# Altium schematic sheet WiFi.SchDoc
size A; DocumentNumber: 7; SheetNumber: 7
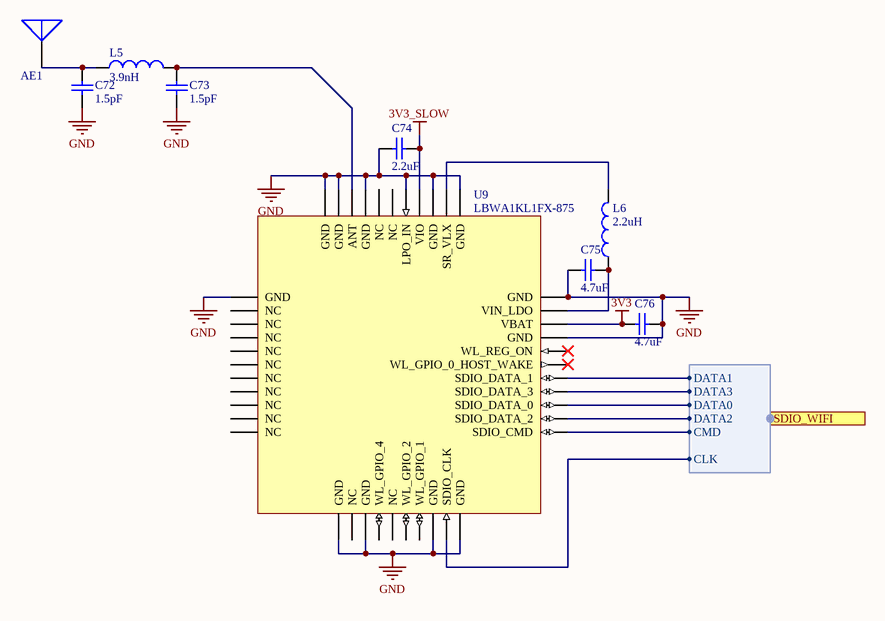
[diagram p0: WiFi.SchDoc]

## Parts
AE1  2450AT42A100E  [ANTENNA (3.2x1.6MM)]  (value not drawn)
C72  value 1.5pF  [C0402[1005X55]]  (hidden comment: 1.5pF 50V 0402)
C73  value 1.5pF  [C0402[1005X55]]  (hidden comment: 1.5pF 50V 0402)
C74  value 2.2uF  [C0402[1005X55]]  (hidden comment: 2.2uF 6.3V 0402)
C75  value 4.7uF  [C0402[1005X55]]  (hidden comment: 4.7uF 6.3V 0402)
C76  value 4.7uF  [C0402[1005X55]]  (hidden comment: 4.7uF 6.3V 0402)
L5  3.9nH  [IND0402]
L6  2.2uH  [IND0603]
U9  LBWA1KL1FX-875  [LGA-42]

## Ports
SDIO_WIFI (harness SDIO)

## Harnesses
SDIO: CLK, CMD, DATA0, DATA1, DATA2, DATA3

## Nets
3V3: C76.2 U9.30(VBAT)
3V3_SLOW: C74.1 U9.36(VIO)
GND: C72.1 C73.1 C74.2 C75.2 C76.1 U9.1(GND) U9.12(GND) U9.14(GND) U9.19(GND) U9.21(GND) U9.29(GND) U9.32(GND) U9.33(GND) U9.35(GND) U9.37(LPO_IN) U9.40(GND) U9.42(GND) U9.43(GND)
NetAE1_1: AE1.1 C72.2 L5.1
NetC73_2: C73.2 L5.2 U9.41(ANT)
NetC75_1: C75.1 L6.1 U9.31(VIN_LDO)
NetL6_2: L6.2 U9.34(SR_VLX)
NetU9_20: U9.20(SDIO_CLK) ; port SDIO_WIFI.CLK
NetU9_22: U9.22(SDIO_CMD) ; port SDIO_WIFI.CMD
NetU9_23: U9.23(SDIO_DATA_2) ; port SDIO_WIFI.DATA2
NetU9_24: U9.24(SDIO_DATA_0) ; port SDIO_WIFI.DATA0
NetU9_25: U9.25(SDIO_DATA_3) ; port SDIO_WIFI.DATA3
NetU9_26: U9.26(SDIO_DATA_1) ; port SDIO_WIFI.DATA1

Not connected (* = marked no-connect by the designer): U9 2(NC) 3(NC) 4(NC) 5(NC) 6(NC) 7(NC) 8(NC) 9(NC) 10(NC) 11(NC) 13(NC) 15(WL_GPIO_4) 16(NC) 17(WL_GPIO_2) 18(WL_GPIO_1) 27(WL_GPIO_0_HOST_WAKE)* 28(WL_REG_ON)* 38(NC) 39(NC)

## Library data of the parts
AE1 = 2450AT42A100E: Manufacturer: Johanson Technology Inc.; PartNumber: 2450AT42A100E; Mounting Technology: Surface Mount
C72 C73 = CAP_1.5pF_50V_0402_0.05pF: 1.5pF 50V 0.05pF 0402 (1005 Metric); PartNumber: GRM1555C1H1R5WA01D; Manufacturer: Murata; Mounting Technology: Surface Mount; PackageReference: 0402; PackageDescription: 0402 (1005 Metric); Voltage: 50V; Tolerance: 0.05pF
C74 = CAP_2.2uF_6.3V_0402_20%: 2.2uF 6.3V 20% 0402 (1005 Metric); PartNumber: GRM155R60J225ME15D; Manufacturer: Murata; Mounting Technology: Surface Mount; PackageReference: 0402; PackageDescription: 0402 (1005 Metric); Voltage: 6.3V; Tolerance: 20%
C75 C76 = CAP_4.7uF_6.3V_0402_20%: 4.7uF 6.3V 20% 0402 (1005 Metric); PartNumber: GRM155R60J475ME47D; Manufacturer: Murata; Mounting Technology: Surface Mount; PackageReference: 0402; PackageDescription: 0402 (1005 Metric); Voltage: 6.3V; Tolerance: 20%
L5 = IND_3.9nH_0.3A_0402_0.3nH: 3.9nH +/-0.3nH 0.3A 0402; PartNumber: LQG15HS3N9S02D; Manufacturer: Murata; PackageReference: 0402; PackageDescription: 0402 (2012 metric); Mounting Technology: Surface Mount; Current: 0.3A; Value: 3.9nH
L6 = IND_2.2uH_750mA_0603_20%: 2.2uH 20% 750mA 0603; PartNumber: LQM18PZ2R2MCHD; Manufacturer: Murata; PackageReference: 0603; PackageDescription: 0603 (1608 metric); Mounting Technology: Surface Mount; Current: 750mA; Value: 2.2uH
U9 = LBWA1KL1FX-875: WI-FI-B/G/N NETWORK CONTROLLER; Manufacturer: Murata; PartNumber: LBWA1KL1FX-875; PackageReference: Module; Mounting Technology: Surface Mount